# Altium schematic sheet SignalProcessing.SchDoc
size A4
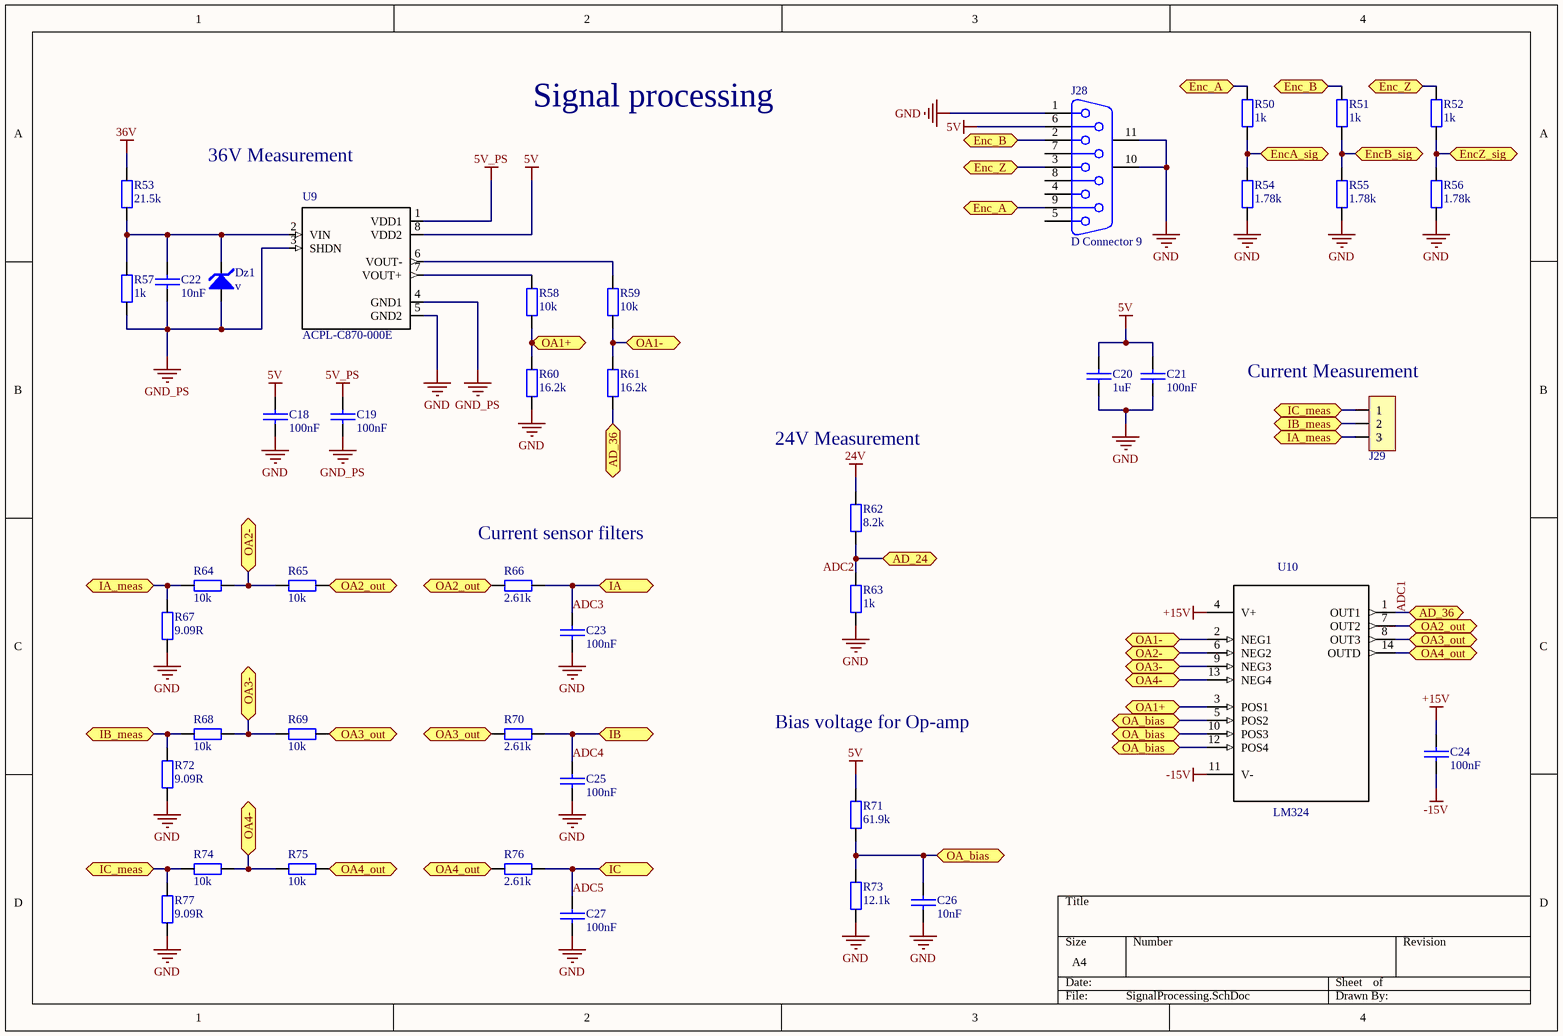
[diagram p0: SignalProcessing.SchDoc]

## Parts
C18  100nF  [1206]
C19  100nF  [1206]
C20  1uF  [1206]
C21  100nF  [1206]
C22  10nF  [1206]
C23  100nF  [1206]
C24  100nF  [1206]
C25  100nF  [1206]
C26  10nF  [1206]
C27  100nF  [1206]
Dz1  v  [Diodo]
J28  D Connector 9  [DSUB1.385-2H9]
J29  Cleva 2 vias  [Con3_KK_256]  (value not drawn)
R50  1k  [1206]
R51  1k  [1206]
R52  1k  [1206]
R53  21.5k  [1206]
R54  1.78k  [1206]
R55  1.78k  [1206]
R56  1.78k  [1206]
R57  1k  [1206]
R58  10k  [1206]
R59  10k  [1206]
R60  16.2k  [1206]
R61  16.2k  [1206]
R62  8.2k  [1206]
R63  1k  [1206]
R64  10k  [1206]
R65  10k  [1206]
R66  2.61k  [1206]
R67  9.09R  [1206]
R68  10k  [1206]
R69  10k  [1206]
R70  2.61k  [1206]
R71  61.9k  [1206]
R72  9.09R  [1206]
R73  12.1k  [1206]
R74  10k  [1206]
R75  10k  [1206]
R76  2.61k  [1206]
R77  9.09R  [1206]
U9  ACPL-C870-000E  [SOIC127P1150X360-8N]
U10  LM324  [SOIC_14]

## Ports
AD_24, AD_36, Enc_A, Enc_B, Enc_Z, EncA_sig, EncB_sig, EncZ_sig, IA, IA_meas, IB, IB_meas, IC, IC_meas, OA1+, OA1-, OA2-, OA2_out, OA3-, OA3_out, OA4-, OA4_out, OA_bias

## Nets
5V: C18.1 C20.2 C21.2 J28.6 R71.2 U9.8(VDD2)
5V_PS: C19.1 U9.1(VDD1)
24V: R62.1
36V: R53.2
+15V: C24.1 U10.4(V+)
-15V: C24.2 U10.11(V-)
GND: C18.2 C20.1 C21.1 C23.1 C25.2 C26.2 C27.1 J28.1 J28.10(MH1) J28.11(MH2) R54.1 R55.1 R56.1 R60.1 R63.1 R67.2 R72.2 R73.2 R77.1 U9.5(GND2)
GND_PS: C19.2 C22.2 Dz1.1(A) R57.2 U9.3(SHDN) U9.4(GND1)
ADC1: R61.1 U10.1(OUT1) ; port AD_36
ADC2: R62.2 R63.2 ; port AD_24
ADC3: C23.2 R66.2 ; port IA
ADC4: C25.1 R70.1 ; port IB
ADC5: C27.2 R76.2 ; port IC
Enc_A: J28.9 R50.2 ; port Enc_A
Enc_B: J28.2 R51.2 ; port Enc_B
Enc_Z: J28.3 R52.2 ; port Enc_Z
EncA_sig: R50.1 R54.2 ; port EncA_sig
EncB_sig: R51.1 R55.2 ; port EncB_sig
EncZ_sig: R52.1 R56.2 ; port EncZ_sig
IA_meas: J29.3 R64.1 R67.1 ; port IA_meas
IB_meas: J29.2 R68.1 R72.1 ; port IB_meas
IC_meas: J29.1 R74.2 R77.2 ; port IC_meas
OA1+: R58.1 R60.2 U10.3(POS1) ; port OA1+
OA1-: R59.1 R61.2 U10.2(NEG1) ; port OA1-
OA2-: R64.2 R65.2 U10.6(NEG2) ; port OA2-
OA2_out: R65.1 R66.1 U10.7(OUT2) ; port OA2_out
OA3-: R68.2 R69.1 U10.9(NEG3) ; port OA3-
OA3_out: R69.2 R70.2 U10.8(OUT3) ; port OA3_out
OA4-: R74.1 R75.2 U10.13(NEG4) ; port OA4-
OA4_out: R75.1 R76.1 U10.14(OUTD) ; port OA4_out
OA_bias: C26.1 R71.1 R73.1 U10.5(POS2) U10.10(POS3) U10.12(POS4) ; port OA_bias
NetC22_1: C22.1 Dz1.2(K) R53.1 R57.1 U9.2(VIN)
NetR58_2: R58.2 U9.7(VOUT+)
NetR59_2: R59.2 U9.6(VOUT-)

Not connected (* = marked no-connect by the designer): J28 4 5 7 8

## Notes on the sheet
- Signal processing
- 36V Measurement
- (near J29) Current Measurement
- 24V Measurement
- (near R66) Current sensor filters
- Bias voltage for Op-amp

## Library data of the parts
C18-C27 = Condensador
Dz1 = Zener
J28 = D Connector 9: Receptacle Assembly, 9 Position, Right Angle; PackageDocument: O; Positions: 9; Published: 15-Jun-2001; LatestRevisionDate: 17-Jul-2002; LatestRevisionNote: Re-released for DXP Platform.; DatasheetDocument: 1-Sep-1999; PackageReference: 788750; Publisher: Altium Limited; Orientation: Right Angle; Gender: Receptacle
J29 = Con_3
R50-R77 = Resistencia: Potencia: 1/4W
U9 = ACPL-C870-000E: Isolation Amplifier [Broadcom] ACPL-C870-000E Isolation Amplifier; MF: Broadcom Limited; Package: SO-8 Broadcom; Digi-Key_Part_Number: 516-2578-5-ND; MP: ACPL-C870-000E; Digi-Key_Purchase_URL: https://www.digikey.dk/product-detail/en/broadcom-limited/ACPL-C870-000E/516-2578-5-ND/3523705?utm_source=snapeda&utm_medium=aggregator&utm_campaign=symbol; SnapEDA_Link: https://www.snapeda.com/parts/ACPL-C870-000E/Broadcom%20Limited/view-part/?ref=snap; Value: *
U10 = LMC6484IM_1: 14 pin CMOS Quad Rail to Rail Input and Output Operational Amplifier 55 per tube; MF: Texas Instruments; Price: None; MP: LMC6484IM; SnapEDA_Link: https://www.snapeda.com/parts/LMC6484IM/Texas%20Instruments/view-part/?ref=snap; Availability: Unavailable; Package: SOIC-14 Texas Instruments; Value: *